# EAGLE design Untitled - halv V3.31 (EAGLE 9.0.0)
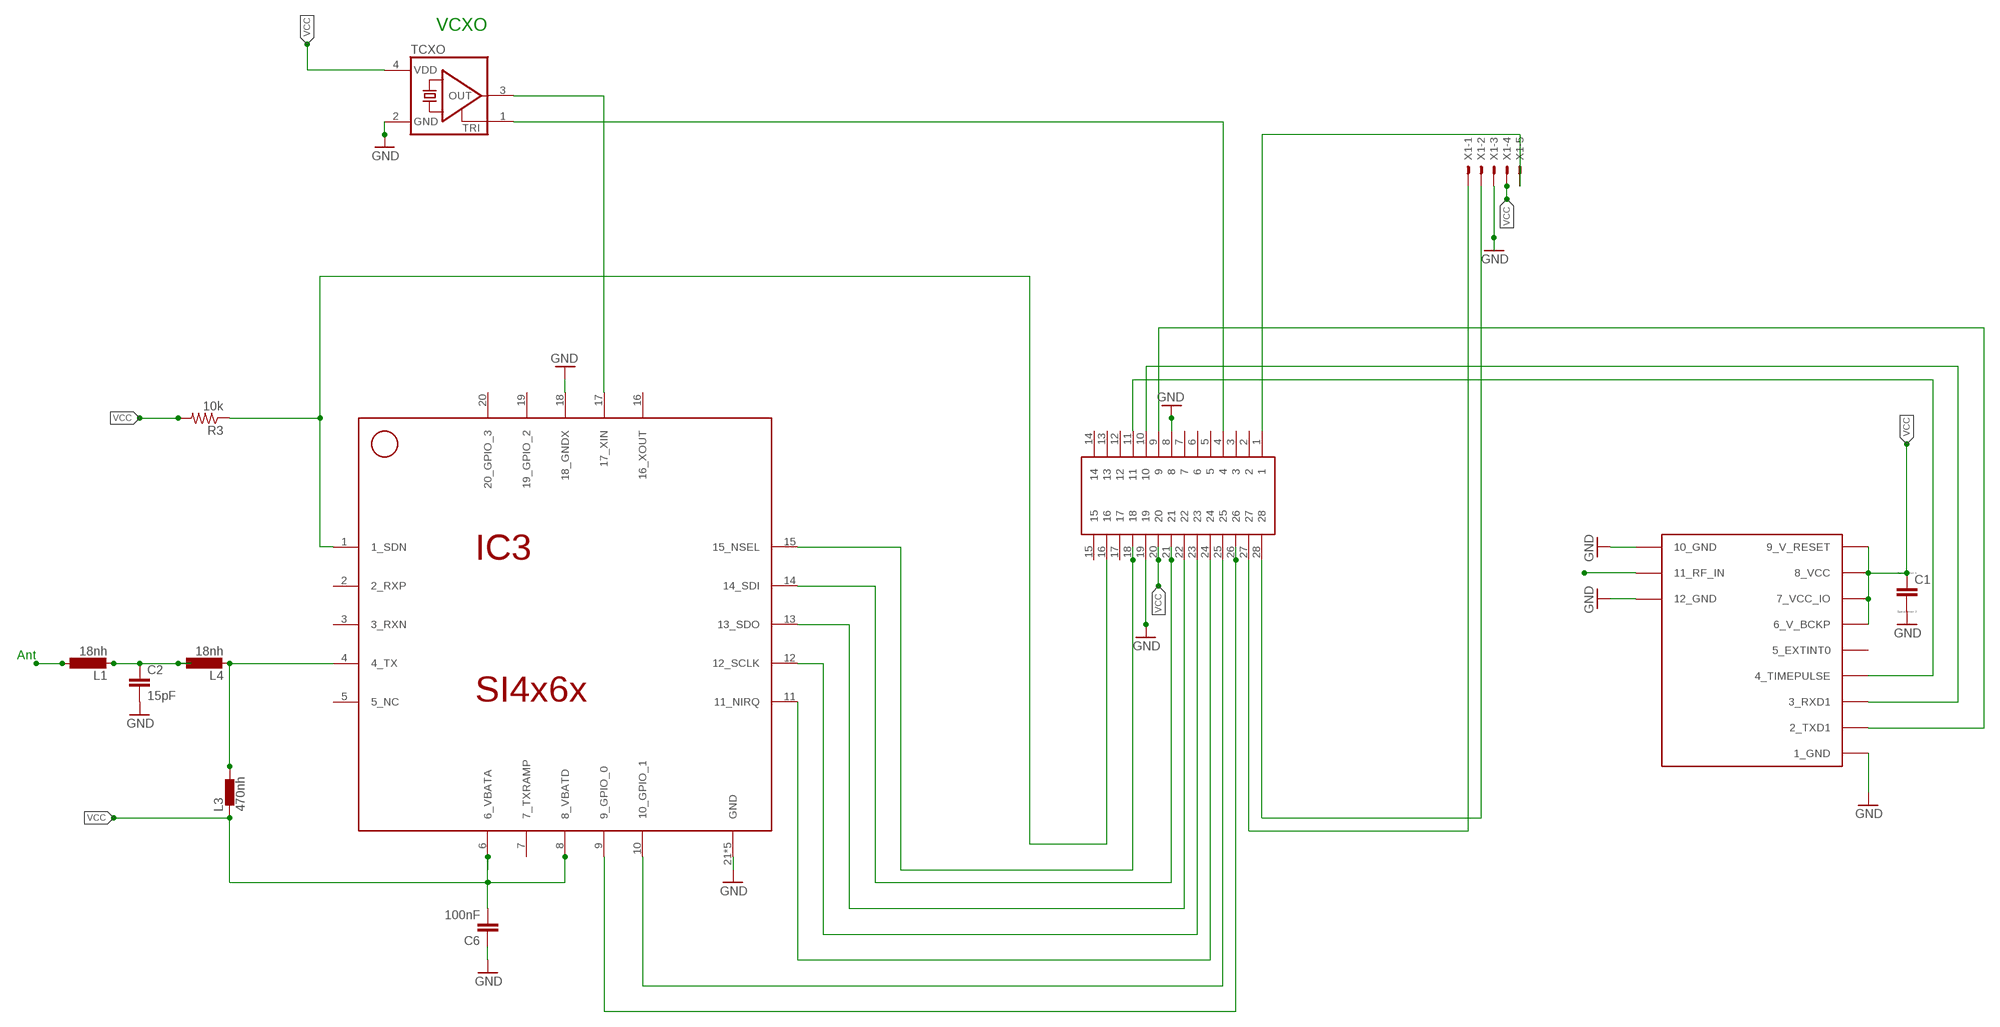
[diagram p0: schematic, sheet 1]

## Parts
C1  CC0603  [C0603]
C2  15pF  C-EUC0603K  [C0603K]
C6  100nF  C-EUC0402  [C0402]
IC3  SI4x6x  SI4463/4  [QFN-20]
L1  18nh  L-EUL2012C  [L2012C]
L3  470nh  BLM15HD601SN1  [0402]
L4  18nh  L-EUL2012C  [L2012C]
PIC-VERS3.3  SSOP28  [SSOP28DB]
R3  10k  R-US_R0402  [R0402]
TCXO  CRYSTAL_3.2X2.5-TCXO  [CRYSTAL_3.2X2.5-TCXO]
U$1  UBLOX_MAX  [UBLOX_MAX]
X1  22-23-2051  [22-23-2051]

## Nets
ANT: U$1.11_RF_IN
GND [vcc]: C1.2 C2.2 C6.1 IC3.18(18_GNDX) IC3.21(GND) IC3.22(GND) IC3.23(GND) IC3.24(GND) IC3.25(GND) PIC-VERS3.3.8 PIC-VERS3.3.19 TCXO.2(GND) U$1.1_GND U$1.10_GND U$1.12_GND X1.3
N$1: PIC-VERS3.3.1 X1.5
N$3: PIC-VERS3.3.28 X1.2
N$4: PIC-VERS3.3.27 X1.1
N$5: IC3.9(9_GPIO_0) PIC-VERS3.3.26
N$7: IC3.10(10_GPIO_1) PIC-VERS3.3.25
N$8: IC3.11(11_NIRQ) PIC-VERS3.3.24
N$9: IC3.12(12_SCLK) PIC-VERS3.3.23
N$10: IC3.13(13_SDO) PIC-VERS3.3.22
N$11: IC3.14(14_SDI) PIC-VERS3.3.21
N$12: IC3.15(15_NSEL) PIC-VERS3.3.18
N$13: IC3.17(17_XIN) TCXO.3(OUT)
N$17: L1.1
N$23: IC3.4(4_TX) L3.2 L4.2
N$25: PIC-VERS3.3.4 TCXO.1(TRI)
N$32: PIC-VERS3.3.11 U$1.4_TIMEPULSE
N$33: PIC-VERS3.3.10 U$1.3_RXD1
N$34: C2.1 L1.2 L4.1
N$36: PIC-VERS3.3.9 U$1.2_TXD1
RADIO_SDN: IC3.1(1_SDN) PIC-VERS3.3.16 R3.1
VCC: C1.1 C6.2 IC3.6(6_VBATA) IC3.8(8_VBATD) L3.1 PIC-VERS3.3.20 R3.2 TCXO.4(VDD) U$1.6_V_BCKP U$1.7_VCC_IO U$1.8_VCC U$1.9_V_RESET X1.4
Unconnected: IC3.2(2_RXP) IC3.3(3_RXN) IC3.5(5_NC) IC3.7(7_TXRAMP) IC3.16(16_XOUT) IC3.19(19_GPIO_2) IC3.20(20_GPIO_3) PIC-VERS3.3.2 PIC-VERS3.3.3 PIC-VERS3.3.5 PIC-VERS3.3.6 PIC-VERS3.3.7 PIC-VERS3.3.12 PIC-VERS3.3.13 PIC-VERS3.3.14 PIC-VERS3.3.15 PIC-VERS3.3.17 U$1.5_EXTINT0

## Notes on the sheet
- VCXO
- Ant

## Library data of the parts
C1 = eagle-ltspice:C: CAPACITOR, European symbol; SPICEMODEL: NONE; SPICEPREFIX: C
C2 = resistor:C-EU: CAPACITOR, European symbol
C6 = rcl:C-EU: CAPACITOR, European symbol
IC3 = KT5TK:SI4463/4
L1 L4 = resistor:L-EU: INDUCTOR, European symbol
L3 = inductors:BLM15H: EMIFIL (R) Chip Ferrite Bead for GHz Noise Source: http://www.murata.com/ Ferrite Bead BLM15H.pdf
PIC-VERS3.3 = SparkFun:SSOP28
R3 = resistor:R-US_: RESISTOR, American symbol
TCXO = picoAVA-R8:CRYSTAL_3.2X2.5-TCXO
U$1 = Max gps:UBLOX_MAX: UBLOX MAX
X1 = con-molex:22-23-2051: .100" (2.54mm) Center Header - 5 Pin; MF: MOLEX; MPN: 22-23-2051; OC_FARNELL: 1462952; OC_NEWARK: 38C9178

## Net classes
0 default: width 0.203 mm
1 vcc: width 0.254 mm

## Board
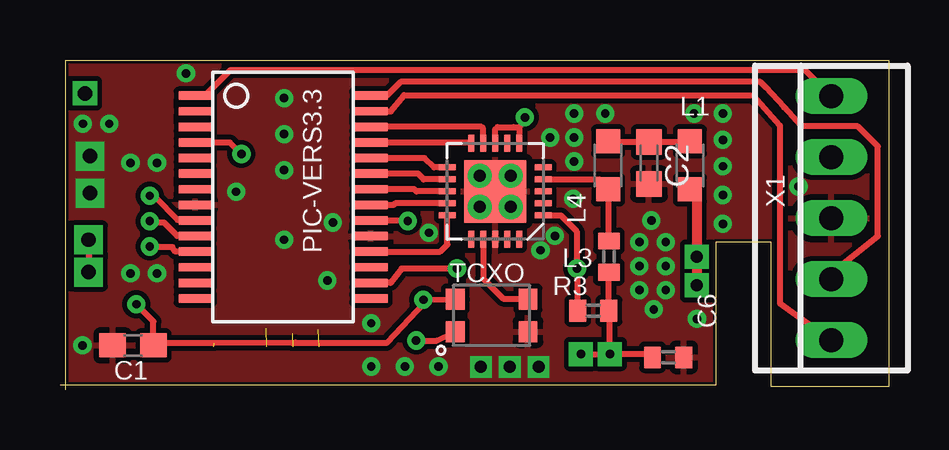
[diagram p1: board, top side]
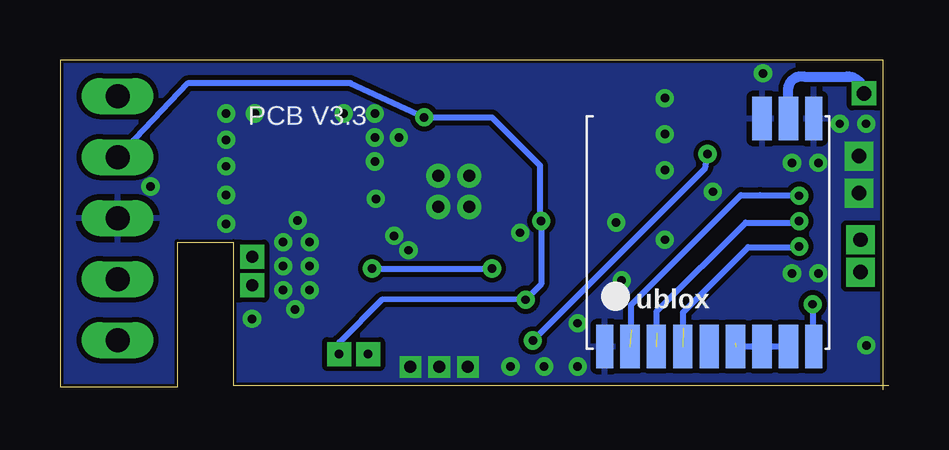
[diagram p2: board, bottom side, seen from below]

Size 34.54 x 13.74 mm. Coordinates in mm from the lower left corner, seen from the top.
Outline: 0,0.19 27.32,0.19 27.32,6.16 29.64,6.16 29.64,0.14 34.54,0.14 34.54,13.74 0.24,13.74 0.24,0
Copper layers (1*16): Top 0.035mm / dielectric 1.5mm / Bottom 0.035mm
Design rules "default": minimum track width 10mil, minimum drill 10mil, track to track 8mil, track to pad 8mil, pad to pad 8mil, via to via 8mil, smd to smd 8mil, copper to edge 5mil, drill to drill 5mil, minimum pad ring 10mil, minimum via ring 8mil, stop-mask expansion 4mil, vias tented up to drill 15mil, thermal gap 10mil

### Footprints (pad centres in the part's own frame; a part is rotated, then mirrored left to right if it is on the bottom)
C0603 = smd 1.1 x 1: 1 -0.85,0; 2 0.85,0
C0603K = smd 1.05 x 1.08: 1 -0.875,0; 2 0.875,0
C0402 = smd 0.7 x 0.9: 1 -0.65,0; 2 0.65,0
QFN-20 = smd 0.7 x 0.25: 1 -2,1; 2 -2,0.5; 3 -2,0; 4 -2,-0.5; 5 -2,-1; 11 2,-1; 12 2,-0.5; 13 2,0; 14 2,0.5; 15 2,1 | smd 0.25 x 0.7: 6 -1,-2; 7 -0.5,-2; 8 0,-2; 9 0.5,-2; 10 1,-2; 16 1,2; 17 0.5,2; 18 0,2; 19 -0.5,2; 20 -1,2 | smd 2.6 x 2.6: 21 0,0 | drill 0.5: 22 -0.65,0.65; 23 0.65,0.65; 24 0.65,-0.65; 25 -0.65,-0.65
L2012C = smd 1 x 1: 1 -1,0; 2 1,0
0402 = smd 0.7 x 0.9: 1 -0.65,0; 2 0.65,0
SSOP28DB = smd 0.348 x 1.397: 1 -4.225,-3.656; 2 -3.575,-3.656; 3 -2.925,-3.656; 4 -2.275,-3.656; 5 -1.625,-3.656; 6 -0.975,-3.656; 7 -0.325,-3.656; 8 0.325,-3.656; 9 0.975,-3.656; 10 1.625,-3.656; 11 2.275,-3.656; 12 2.925,-3.656; 13 3.575,-3.656; 14 4.225,-3.656; 15 4.225,3.656; 16 3.575,3.656; 17 2.925,3.656; 18 2.275,3.656; 19 1.625,3.656; 20 0.975,3.656; 21 0.325,3.656; 22 -0.325,3.656; 23 -0.975,3.656; 24 -1.625,3.656; 25 -2.275,3.656; 26 -2.925,3.656; 27 -3.575,3.656; 28 -4.225,3.656
R0402 = smd 0.7 x 0.9: 1 -0.65,0; 2 0.65,0
CRYSTAL_3.2X2.5-TCXO = smd 0.78 x 0.87: 1 -1.515,-0.68; 2 1.515,-0.68; 3 1.515,0.68; 4 -1.515,0.68
UBLOX_MAX = smd 1.8 x 0.7: 1_GND 4.95,-4.4; 9_V_RESET 4.95,4.3; 10_GND -4.55,4.3 | smd 1.8 x 0.8: 2_TXD1 4.95,-3.35; 3_RXD1 4.95,-2.25; 4_TIMEPULSE 4.95,-1.15; 5_EXTINT0 4.95,-0.05; 6_V_BCKP 4.95,1.05; 7_VCC_IO 4.95,2.15; 8_VCC 4.95,3.25; 11_RF_IN -4.55,3.25; 12_GND -4.55,2.15
22-23-2051 = drill 1 long: 1 -5.08,0; 2 -2.54,0; 3 0,0; 4 2.54,0; 5 5.08,0

### Placement (x,y rotation side)
C1  3.04,1.86 180 top
C2  24.54,9.46 270 top
C6  25.34,1.36 180 top
IC3  18.13,8.27 180 top
L1  26.24,9.36 90 top
L3  22.87,5.56 90 top
L4  22.84,9.36 270 top
PIC-VERS3.3  9.29,8.04 270 top
R3  22.22,3.3 0 top
TCXO  17.98,3.11 0 top
U$1  7.44,6.76 270 bottom
X1  32.14,7.16 90 top

### Tracks (layer width: path | path; a pad name or v marks a point on that pad's centre or on a via)
ANT  (via drill 0.6 pad 1)
  Bottom 0.406: U$1.11_RF_IN 4.19,12.61 arc90 3.54,13.06 1.74,13.06 arc90 v1.04,12.36
GND  (via drill 0.35, 0.5 pad 0.25, 0.6 pad 1.2)
  other vias: 1.25,9.74 1.25,8.2 19.94,0.96 18.74,0.96 17.54,0.96 4.04,9.46 11.14,4.56 5.25,13.19 20.62,6.42 12.97,0.98 4.04,4.86 25.24,6.16 27.62,6.92 27.62,8.12 27.62,9.32 27.62,10.42 26.42,11.52 9.34,9.16 25.24,5.16 25.24,4.16 26.54,2.96 21.38,7.96 14.37,0.98 15.77,0.98 27.62,11.52 22.72,11.52 9.34,6.26 20.02,5.82 2.94,9.46 2.94,4.86 11.37,6.98 15.37,6.55 30.77,8.48 21.42,11.52 21.42,10.52 21.42,9.52 20.42,10.52 24.14,6.16 24.14,5.16 24.14,4.16 7.34,8.26 24.64,7.06 24.74,3.36 9.34,10.66 9.34,12.16 0.94,1.86 12.97,2.78 0.95,11.09 2.05,11.09
  pour Bottom: -0.96,15.22 37.34,15.22 37.34,-1.47 -0.96,-1.54
  pour Top: -0.97,15.22 37.33,15.22 37.34,-1.44 -0.96,-1.54
N$1
  Top 0.254: X1.5 31.05,13.33 7.1,13.33 6.03,12.26 PIC-VERS3.3.1
N$3
  Top 0.254: PIC-VERS3.3.28 13.61,12.26 14.19,12.84 29.18,12.84 29.41,12.61 30.17,11.78 30.19,11.78 30.88,10.98 33.24,10.98 34.08,10.15 34.08,6.41 32.14,4.87 X1.2
N$4
  Top 0.254: PIC-VERS3.3.27 13.1,11.61 13.79,11.61 14.34,12.28 28.89,12.28 29.99,11.02 29.99,3.61 X1.1
N$5
  Top 0.254: IC3.9 17.63,10.9 17.57,10.96 PIC-VERS3.3.26
N$7
  Top 0.254: 12.99,10.27 PIC-VERS3.3.25 17.1,10.31 IC3.10
N$8
  Top 0.254: IC3.11 15.59,9.27 15.2,9.66 PIC-VERS3.3.24
N$9
  Top 0.254: IC3.12 15.16,8.77 14.92,9.01 PIC-VERS3.3.23
N$10
  Top 0.254: IC3.13 14.85,8.27 14.75,8.37 PIC-VERS3.3.22
N$11
  Top 0.254: 12.95,7.73 PIC-VERS3.3.21 12.96,7.7 13.89,7.7 13.96,7.77 IC3.14
N$12
  Top 0.254: PIC-VERS3.3.18 15.84,5.76 16.14,6.06 IC3.15
N$13
  Top 0.254: IC3.17 17.63,4.64 18.46,3.81 19.47,3.81 TCXO.3
N$14  (via drill 0.6 pad 1.2)
  Top 0.254: v1.19,6.26 v1.19,4.91
N$17  (via drill 0.5 pad 1)
  Top 0.406: v26.54,4.36 v26.54,5.56 26.54,8.06 L1.1
N$23
  Top 0.254: IC3.4 22.48,8.77 L4.2 22.87,8.13 L3.2
N$25  (via drill 0.35)
  Top 0.254: v14.84,2.06 15.7,2.06 TCXO.1 | PIC-VERS3.3.4 7.08,10.31 v7.56,9.83
  Bottom 0.254: v14.84,2.06 7.66,9.24 v7.56,9.83
N$32  (via drill 0.35)  (1 unrouted)
  Top 0.254: v3.74,5.98 3.77,5.95 4.69,5.95 4.81,5.76 5.61,5.76 PIC-VERS3.3.11
  Bottom 0.254: v3.74,5.98 3.77,5.95 5.87,5.95 8.58,3.24 8.58,2.57
N$33  (via drill 0.35)  (1 unrouted)
  Top 0.254: v3.74,7.03 3.77,6.98 4.34,6.98 4.88,6.42 5.68,6.42 PIC-VERS3.3.10
  Bottom 0.254: v3.74,7.03 3.77,6.98 5.97,6.98 9.68,3.27 9.68,2.37
N$34
  Top 0.254: L4.1 22.87,10.34 C2.1 26.17,10.34 26.27,10.43
  Top 0.406: L4.1 22.98,10.5 | 26.3,10.5 26.27,10.43 L1.2
N$36  (via drill 0.35)  (1 unrouted)
  Top 0.254: 5.49,7.11 PIC-VERS3.3.9 5.35,7.09 4.89,7.09 4,8 3.77,8 v3.74,8.09
  Bottom 0.254: 10.74,2.52 10.74,3.55 6.17,8.12 5.37,8.12 3.77,8.12 v3.74,8.09
RADIO_SDN  (via drill 0.35)
  Top 0.254: R3.1 21.57,4.99 | 21.57,4.99 v21.54,5.06 | PIC-VERS3.3.16 13.09,4.46 13.78,4.46 14.24,5.06 v16.54,5.06 | IC3.1 20.87,7.27 21.53,6.61 21.53,5.03 21.57,4.99
  Bottom 0.254: v21.54,5.06 v16.54,5.06
VCC  (via drill 0.35, 0.35 pad 1)  (1 unrouted)
  Top 0.254: 12.81,7.09 12.85,7.06 PIC-VERS3.3.20 12.97,7.04 v14.49,7.04 | 9.67,1.96 6.41,1.95 3.98,1.95 C1.1 3.89,2.86 v3.18,3.57 | 9.67,1.96 9.83,1.96 9.82,1.97 | 16.23,3.79 TCXO.4 16.76,3.78 v15.14,3.76 15.2,3.66 13.61,1.96 9.67,1.96 | v21.7,1.49 v22.91,1.49 | v22.91,1.49 22.91,3.46 R3.2 L3.1 | v19.37,11.36 19.54,11.36 19.13,10.95 | 19.13,10.95 IC3.6 | IC3.8 18.13,10.85 18.23,10.95 18.9,10.95 | 18.9,10.95 | 18.9,10.95 19.13,10.95 | C6.2 24.56,1.49 v22.91,1.49
  Bottom 0.254: v22.91,1.49 22.89,1.99 21.11,3.78 v15.14,3.76 14.49,4.41 v14.49,7.04 14.54,7.09 14.54,9.36 16.54,11.36 v19.37,11.36 22.44,12.78 29.22,12.77 X1.4 | 3.19,3.66 v3.18,3.57 3.18,2.15 U$1.9_V_RESET | U$1.8_VCC U$1.7_VCC_IO U$1.6_V_BCKP

### Text on the board
bNames: PCB V3.3